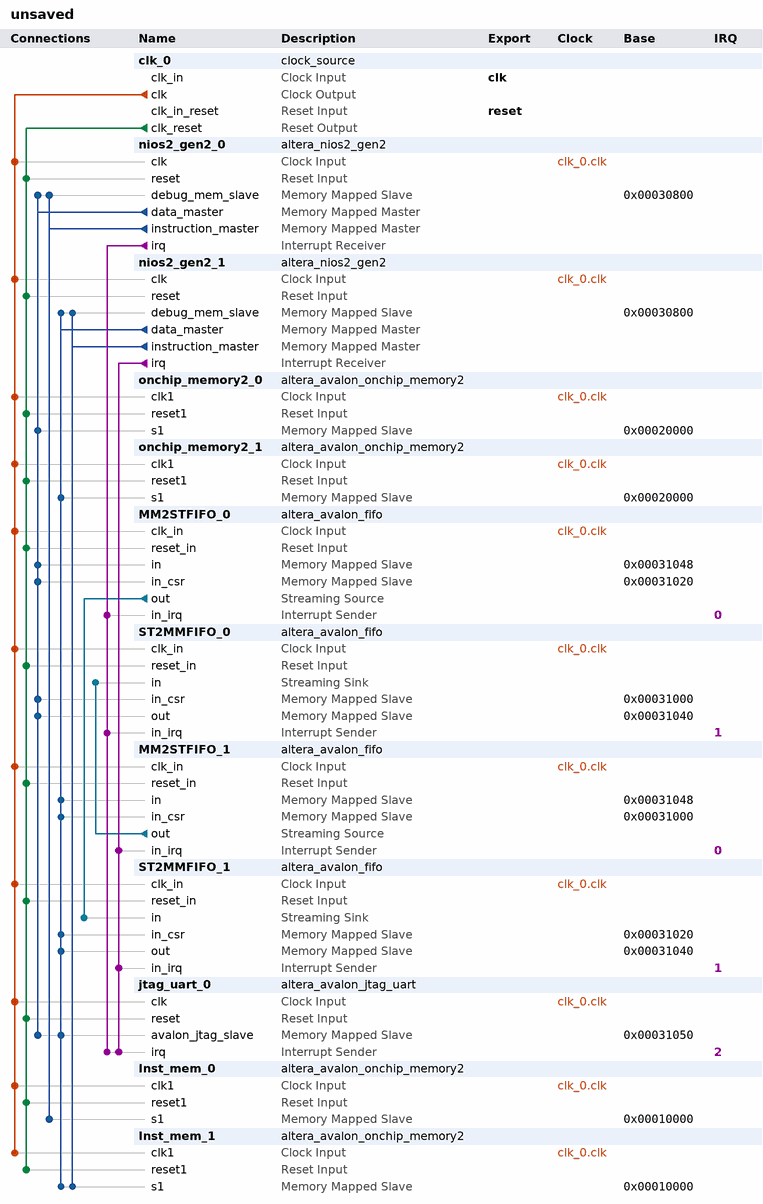
[diagram p0: system contents]
# Platform Designer (Qsys) system unsaved, Cyclone V 5CSEMA4U23C6
# Parameters at their usual value, and those the tool derives, are not listed.
package require -exact qsys 17.1
create_system unsaved
set_project_property DEVICE_FAMILY {Cyclone V}
set_project_property DEVICE 5CSEMA4U23C6

add_instance clk_0 clock_source 17.1
set_instance_parameter_value clk_0 clockFrequency 50000000

add_instance nios2_gen2_0 altera_nios2_gen2 17.1
set_instance_parameter_value nios2_gen2_0 dcache_size 2048
set_instance_parameter_value nios2_gen2_0 exceptionSlave Inst_mem_0.s1
set_instance_parameter_value nios2_gen2_0 icache_size 4096
set_instance_parameter_value nios2_gen2_0 impl Tiny
set_instance_parameter_value nios2_gen2_0 resetSlave Inst_mem_0.s1

add_instance nios2_gen2_1 altera_nios2_gen2 17.1
set_instance_parameter_value nios2_gen2_1 dcache_size 2048
set_instance_parameter_value nios2_gen2_1 exceptionSlave Inst_mem_1.s1
set_instance_parameter_value nios2_gen2_1 icache_size 4096
set_instance_parameter_value nios2_gen2_1 impl Tiny
set_instance_parameter_value nios2_gen2_1 resetSlave Inst_mem_1.s1

add_instance onchip_memory2_0 altera_avalon_onchip_memory2 17.1
set_instance_parameter_value onchip_memory2_0 dataWidth 32
set_instance_parameter_value onchip_memory2_0 dualPort false
set_instance_parameter_value onchip_memory2_0 initMemContent true
set_instance_parameter_value onchip_memory2_0 initializationFileName onchip_mem.hex
set_instance_parameter_value onchip_memory2_0 memorySize 65536

add_instance onchip_memory2_1 altera_avalon_onchip_memory2 17.1
set_instance_parameter_value onchip_memory2_1 dataWidth 32
set_instance_parameter_value onchip_memory2_1 dualPort false
set_instance_parameter_value onchip_memory2_1 initMemContent true
set_instance_parameter_value onchip_memory2_1 initializationFileName onchip_mem.hex
set_instance_parameter_value onchip_memory2_1 memorySize 65536

add_instance MM2STFIFO_0 altera_avalon_fifo 17.1
set_instance_parameter_value MM2STFIFO_0 bitsPerSymbol 8
set_instance_parameter_value MM2STFIFO_0 channelWidth 8
set_instance_parameter_value MM2STFIFO_0 errorWidth 8
set_instance_parameter_value MM2STFIFO_0 fifoDepth 16
set_instance_parameter_value MM2STFIFO_0 fifoInputInterfaceOptions AVALONMM_WRITE
set_instance_parameter_value MM2STFIFO_0 fifoOutputInterfaceOptions AVALONST_SOURCE
set_instance_parameter_value MM2STFIFO_0 singleClockMode true
set_instance_parameter_value MM2STFIFO_0 symbolsPerBeat 4
set_instance_parameter_value MM2STFIFO_0 useIRQ true
set_instance_parameter_value MM2STFIFO_0 usePacket false
set_instance_parameter_value MM2STFIFO_0 useReadControl false

add_instance ST2MMFIFO_0 altera_avalon_fifo 17.1
set_instance_parameter_value ST2MMFIFO_0 bitsPerSymbol 8
set_instance_parameter_value ST2MMFIFO_0 channelWidth 8
set_instance_parameter_value ST2MMFIFO_0 errorWidth 8
set_instance_parameter_value ST2MMFIFO_0 fifoDepth 16
set_instance_parameter_value ST2MMFIFO_0 fifoInputInterfaceOptions AVALONST_SINK
set_instance_parameter_value ST2MMFIFO_0 fifoOutputInterfaceOptions AVALONMM_READ
set_instance_parameter_value ST2MMFIFO_0 singleClockMode true
set_instance_parameter_value ST2MMFIFO_0 symbolsPerBeat 4
set_instance_parameter_value ST2MMFIFO_0 useIRQ true
set_instance_parameter_value ST2MMFIFO_0 usePacket false
set_instance_parameter_value ST2MMFIFO_0 useReadControl false

add_instance MM2STFIFO_1 altera_avalon_fifo 17.1
set_instance_parameter_value MM2STFIFO_1 bitsPerSymbol 8
set_instance_parameter_value MM2STFIFO_1 channelWidth 8
set_instance_parameter_value MM2STFIFO_1 errorWidth 8
set_instance_parameter_value MM2STFIFO_1 fifoDepth 16
set_instance_parameter_value MM2STFIFO_1 fifoInputInterfaceOptions AVALONMM_WRITE
set_instance_parameter_value MM2STFIFO_1 fifoOutputInterfaceOptions AVALONST_SOURCE
set_instance_parameter_value MM2STFIFO_1 singleClockMode true
set_instance_parameter_value MM2STFIFO_1 symbolsPerBeat 4
set_instance_parameter_value MM2STFIFO_1 useIRQ true
set_instance_parameter_value MM2STFIFO_1 usePacket false
set_instance_parameter_value MM2STFIFO_1 useReadControl false

add_instance ST2MMFIFO_1 altera_avalon_fifo 17.1
set_instance_parameter_value ST2MMFIFO_1 bitsPerSymbol 8
set_instance_parameter_value ST2MMFIFO_1 channelWidth 8
set_instance_parameter_value ST2MMFIFO_1 errorWidth 8
set_instance_parameter_value ST2MMFIFO_1 fifoDepth 16
set_instance_parameter_value ST2MMFIFO_1 fifoInputInterfaceOptions AVALONST_SINK
set_instance_parameter_value ST2MMFIFO_1 fifoOutputInterfaceOptions AVALONMM_READ
set_instance_parameter_value ST2MMFIFO_1 singleClockMode true
set_instance_parameter_value ST2MMFIFO_1 symbolsPerBeat 4
set_instance_parameter_value ST2MMFIFO_1 useIRQ true
set_instance_parameter_value ST2MMFIFO_1 usePacket false
set_instance_parameter_value ST2MMFIFO_1 useReadControl false

add_instance jtag_uart_0 altera_avalon_jtag_uart 17.1
set_instance_parameter_value jtag_uart_0 simInteractiveOptions NO_INTERACTIVE_WINDOWS

add_instance Inst_mem_0 altera_avalon_onchip_memory2 17.1
set_instance_parameter_value Inst_mem_0 dataWidth 32
set_instance_parameter_value Inst_mem_0 dualPort false
set_instance_parameter_value Inst_mem_0 initMemContent true
set_instance_parameter_value Inst_mem_0 initializationFileName onchip_mem.hex
set_instance_parameter_value Inst_mem_0 memorySize 65536

add_instance Inst_mem_1 altera_avalon_onchip_memory2 17.1
set_instance_parameter_value Inst_mem_1 dataWidth 32
set_instance_parameter_value Inst_mem_1 dualPort false
set_instance_parameter_value Inst_mem_1 initMemContent true
set_instance_parameter_value Inst_mem_1 initializationFileName onchip_mem.hex
set_instance_parameter_value Inst_mem_1 memorySize 65536

# connections
add_connection clk_0.clk Inst_mem_0.clk1 clock
add_connection clk_0.clk Inst_mem_0.clk1 clock
add_connection clk_0.clk Inst_mem_1.clk1 clock
add_connection clk_0.clk Inst_mem_1.clk1 clock
add_connection clk_0.clk jtag_uart_0.clk clock
add_connection clk_0.clk MM2STFIFO_0.clk_in clock
add_connection clk_0.clk MM2STFIFO_1.clk_in clock
add_connection clk_0.clk nios2_gen2_0.clk clock
add_connection clk_0.clk nios2_gen2_1.clk clock
add_connection clk_0.clk onchip_memory2_0.clk1 clock
add_connection clk_0.clk onchip_memory2_1.clk1 clock
add_connection clk_0.clk ST2MMFIFO_0.clk_in clock
add_connection clk_0.clk ST2MMFIFO_1.clk_in clock
add_connection clk_0.clk_reset Inst_mem_0.reset1 reset
add_connection clk_0.clk_reset Inst_mem_0.reset1 reset
add_connection clk_0.clk_reset Inst_mem_1.reset1 reset
add_connection clk_0.clk_reset Inst_mem_1.reset1 reset
add_connection clk_0.clk_reset jtag_uart_0.reset reset
add_connection clk_0.clk_reset MM2STFIFO_0.reset_in reset
add_connection clk_0.clk_reset MM2STFIFO_1.reset_in reset
add_connection clk_0.clk_reset nios2_gen2_0.reset reset
add_connection clk_0.clk_reset nios2_gen2_1.reset reset
add_connection clk_0.clk_reset onchip_memory2_0.reset1 reset
add_connection clk_0.clk_reset onchip_memory2_1.reset1 reset
add_connection clk_0.clk_reset ST2MMFIFO_0.reset_in reset
add_connection clk_0.clk_reset ST2MMFIFO_1.reset_in reset
add_connection nios2_gen2_0.data_master jtag_uart_0.avalon_jtag_slave avalon
set_connection_parameter_value nios2_gen2_0.data_master/jtag_uart_0.avalon_jtag_slave baseAddress 0x00031050
add_connection nios2_gen2_0.data_master MM2STFIFO_0.in avalon
set_connection_parameter_value nios2_gen2_0.data_master/MM2STFIFO_0.in baseAddress 0x00031048
add_connection nios2_gen2_0.data_master MM2STFIFO_0.in_csr avalon
set_connection_parameter_value nios2_gen2_0.data_master/MM2STFIFO_0.in_csr baseAddress 0x00031020
add_connection nios2_gen2_0.data_master nios2_gen2_0.debug_mem_slave avalon
set_connection_parameter_value nios2_gen2_0.data_master/nios2_gen2_0.debug_mem_slave baseAddress 0x00030800
add_connection nios2_gen2_0.data_master onchip_memory2_0.s1 avalon
set_connection_parameter_value nios2_gen2_0.data_master/onchip_memory2_0.s1 baseAddress 0x00020000
add_connection nios2_gen2_0.data_master ST2MMFIFO_0.in_csr avalon
set_connection_parameter_value nios2_gen2_0.data_master/ST2MMFIFO_0.in_csr baseAddress 0x00031000
add_connection nios2_gen2_0.data_master ST2MMFIFO_0.out avalon
set_connection_parameter_value nios2_gen2_0.data_master/ST2MMFIFO_0.out baseAddress 0x00031040
add_connection nios2_gen2_0.instruction_master Inst_mem_0.s1 avalon
set_connection_parameter_value nios2_gen2_0.instruction_master/Inst_mem_0.s1 baseAddress 0x00010000
add_connection nios2_gen2_0.instruction_master Inst_mem_0.s1 avalon
set_connection_parameter_value nios2_gen2_0.instruction_master/Inst_mem_0.s1 baseAddress 0x00010000
add_connection nios2_gen2_0.instruction_master nios2_gen2_0.debug_mem_slave avalon
set_connection_parameter_value nios2_gen2_0.instruction_master/nios2_gen2_0.debug_mem_slave baseAddress 0x00030800
add_connection nios2_gen2_1.data_master Inst_mem_1.s1 avalon
set_connection_parameter_value nios2_gen2_1.data_master/Inst_mem_1.s1 baseAddress 0x00010000
add_connection nios2_gen2_1.data_master jtag_uart_0.avalon_jtag_slave avalon
set_connection_parameter_value nios2_gen2_1.data_master/jtag_uart_0.avalon_jtag_slave baseAddress 0x00031050
add_connection nios2_gen2_1.data_master MM2STFIFO_1.in avalon
set_connection_parameter_value nios2_gen2_1.data_master/MM2STFIFO_1.in baseAddress 0x00031048
add_connection nios2_gen2_1.data_master MM2STFIFO_1.in_csr avalon
set_connection_parameter_value nios2_gen2_1.data_master/MM2STFIFO_1.in_csr baseAddress 0x00031000
add_connection nios2_gen2_1.data_master nios2_gen2_1.debug_mem_slave avalon
set_connection_parameter_value nios2_gen2_1.data_master/nios2_gen2_1.debug_mem_slave baseAddress 0x00030800
add_connection nios2_gen2_1.data_master onchip_memory2_1.s1 avalon
set_connection_parameter_value nios2_gen2_1.data_master/onchip_memory2_1.s1 baseAddress 0x00020000
add_connection nios2_gen2_1.data_master ST2MMFIFO_1.in_csr avalon
set_connection_parameter_value nios2_gen2_1.data_master/ST2MMFIFO_1.in_csr baseAddress 0x00031020
add_connection nios2_gen2_1.data_master ST2MMFIFO_1.out avalon
set_connection_parameter_value nios2_gen2_1.data_master/ST2MMFIFO_1.out baseAddress 0x00031040
add_connection nios2_gen2_1.instruction_master Inst_mem_1.s1 avalon
set_connection_parameter_value nios2_gen2_1.instruction_master/Inst_mem_1.s1 baseAddress 0x00010000
add_connection nios2_gen2_1.instruction_master nios2_gen2_1.debug_mem_slave avalon
set_connection_parameter_value nios2_gen2_1.instruction_master/nios2_gen2_1.debug_mem_slave baseAddress 0x00030800
add_connection MM2STFIFO_0.out ST2MMFIFO_1.in avalon_streaming
add_connection MM2STFIFO_1.out ST2MMFIFO_0.in avalon_streaming
add_connection nios2_gen2_0.irq jtag_uart_0.irq interrupt
set_connection_parameter_value nios2_gen2_0.irq/jtag_uart_0.irq irqNumber 2
add_connection nios2_gen2_0.irq MM2STFIFO_0.in_irq interrupt
set_connection_parameter_value nios2_gen2_0.irq/MM2STFIFO_0.in_irq irqNumber 0
add_connection nios2_gen2_0.irq ST2MMFIFO_0.in_irq interrupt
set_connection_parameter_value nios2_gen2_0.irq/ST2MMFIFO_0.in_irq irqNumber 1
add_connection nios2_gen2_1.irq jtag_uart_0.irq interrupt
set_connection_parameter_value nios2_gen2_1.irq/jtag_uart_0.irq irqNumber 2
add_connection nios2_gen2_1.irq MM2STFIFO_1.in_irq interrupt
set_connection_parameter_value nios2_gen2_1.irq/MM2STFIFO_1.in_irq irqNumber 0
add_connection nios2_gen2_1.irq ST2MMFIFO_1.in_irq interrupt
set_connection_parameter_value nios2_gen2_1.irq/ST2MMFIFO_1.in_irq irqNumber 1

# exported interfaces
add_interface clk clock sink
set_interface_property clk EXPORT_OF clk_0.clk_in
add_interface reset reset sink
set_interface_property reset EXPORT_OF clk_0.clk_in_reset

set_interconnect_requirement {$system} qsys_mm.clockCrossingAdapter HANDSHAKE
set_interconnect_requirement {$system} qsys_mm.enableEccProtection FALSE
set_interconnect_requirement {$system} qsys_mm.insertDefaultSlave FALSE
set_interconnect_requirement {$system} qsys_mm.maxAdditionalLatency 1

save_system unsaved.qsys
